# Altium schematic sheet MicroSD.SchDoc
size A4; SheetNumber: 5; SheetTotal: 7
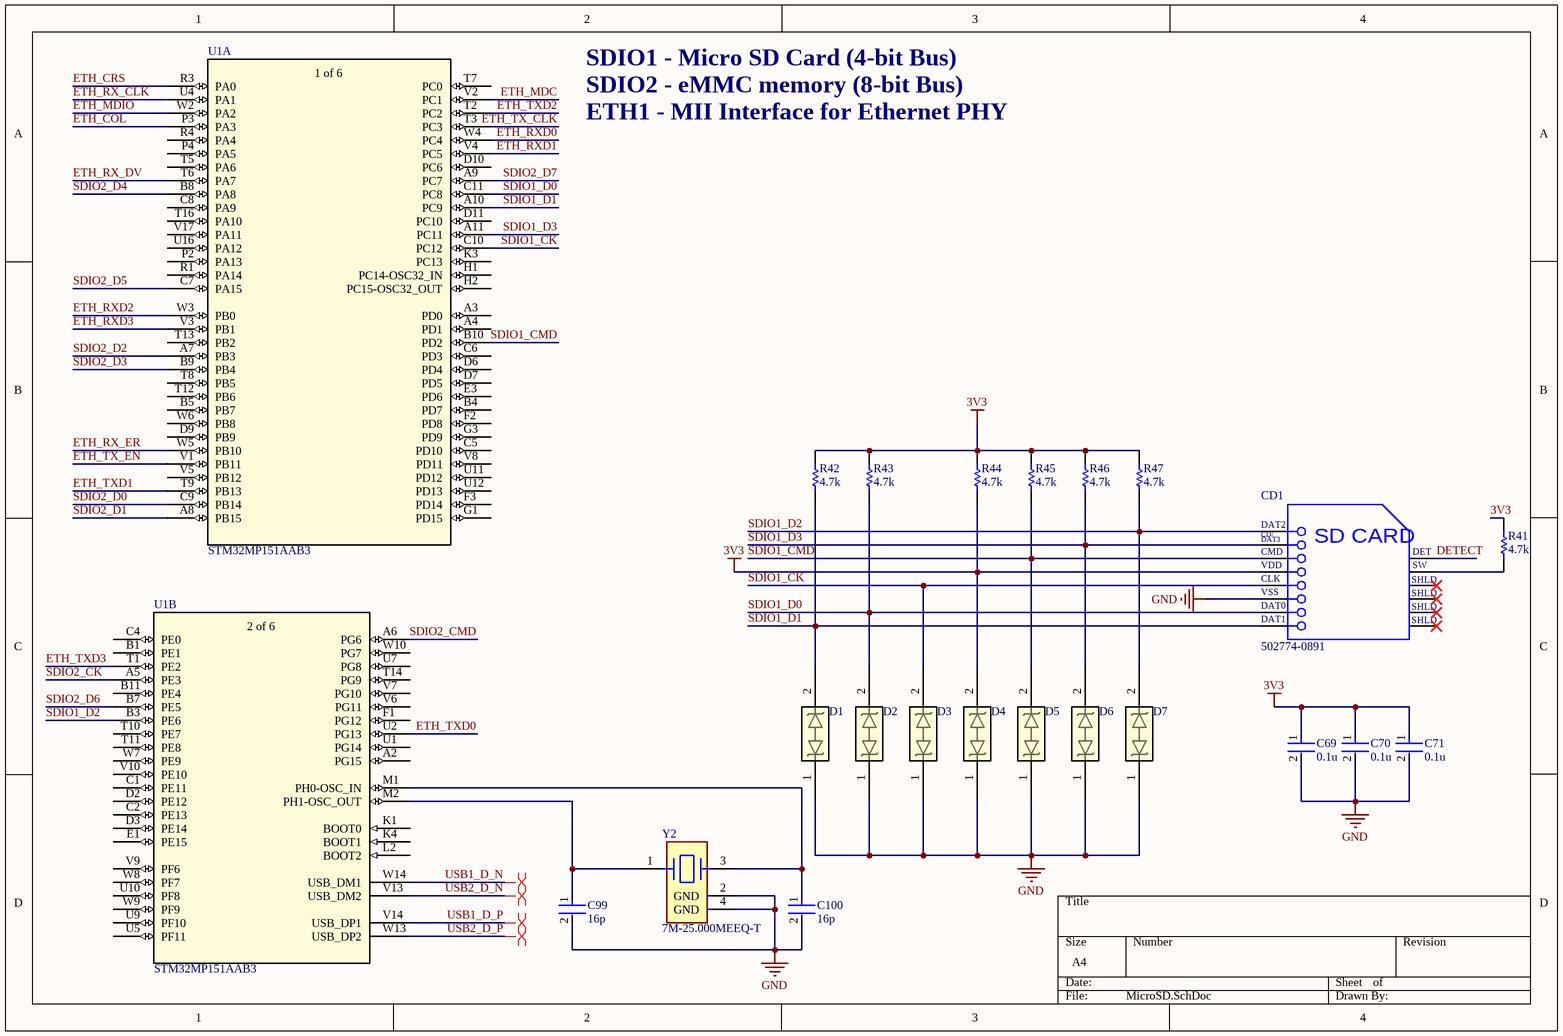
[diagram p0: MicroSD.SchDoc]

## Parts
C69  0.1u  [FP-C0603C-CF-MFG]
C70  0.1u  [FP-C0603C-CF-MFG]
C71  0.1u  [FP-C0603C-CF-MFG]
C99  16p  [FP-C0603C-CF-MFG]
C100  16p  [FP-C0603C-CF-MFG]
CD1  502774-0891  [MOLX-502774-0891_V]
D1  DESD5V0U1BA-7  [SOD-323]  (value not drawn)
D2  DESD5V0U1BA-7  [SOD-323]  (value not drawn)
D3  DESD5V0U1BA-7  [SOD-323]  (value not drawn)
D4  DESD5V0U1BA-7  [SOD-323]  (value not drawn)
D5  DESD5V0U1BA-7  [SOD-323]  (value not drawn)
D6  DESD5V0U1BA-7  [SOD-323]  (value not drawn)
D7  DESD5V0U1BA-7  [SOD-323]  (value not drawn)
R41  4.7k  [RESC1609X50X30NL8T20]
R42  4.7k  [RESC1609X50X30NL8T20]
R43  4.7k  [RESC1609X50X30NL8T20]
R44  4.7k  [RESC1609X50X30NL8T20]
R45  4.7k  [RESC1609X50X30NL8T20]
R46  4.7k  [RESC1609X50X30NL8T20]
R47  4.7k  [RESC1609X50X30NL8T20]
U1  STM32MP151AAB3  [LFBGA354_16X16_STM]  (parts A,B of 6)
Y2  7M-25.000MEEQ-T  [FP-7M-MFG]

## Nets
3V3: C69.1 C70.1 C71.1 CD1.4(VDD) D4.2 R41.2 R42.2 R43.2 R44.1 R44.2 R45.2 R46.2 R47.2
GND: C69.2 C70.2 C71.2 C99.2 C100.2 CD1.6(VSS) D1.1 D2.1 D3.1 D4.1 D5.1 D6.1 D7.1 Y2.2(GND) Y2.4(GND)
DETECT: CD1.9(DETECT)
ETH_COL: U1.P3(PA3)
ETH_CRS: U1.R3(PA0)
ETH_MDC: U1.V2(PC1)
ETH_MDIO: U1.W2(PA2)
ETH_RX_CLK: U1.U4(PA1)
ETH_RX_DV: U1.T6(PA7)
ETH_RX_ER: U1.W5(PB10)
ETH_RXD0: U1.W4(PC4)
ETH_RXD1: U1.V4(PC5)
ETH_RXD2: U1.W3(PB0)
ETH_RXD3: U1.V3(PB1)
ETH_TX_CLK: U1.T3(PC3)
ETH_TX_EN: U1.V1(PB11)
ETH_TXD0: U1.U2(PG13)
ETH_TXD1: U1.T9(PB13)
ETH_TXD2: U1.T2(PC2)
ETH_TXD3: U1.T1(PE2)
SDIO1_CK: CD1.5(CLK) D3.2 U1.C10(PC12)
SDIO1_CMD: CD1.3(CMD) D5.2 R45.1 U1.B10(PD2)
SDIO1_D0: CD1.7(DAT0) D2.2 R43.1 U1.C11(PC8)
SDIO1_D1: CD1.8(DAT1) D1.2 R42.1 U1.A10(PC9)
SDIO1_D2: CD1.1(DAT2) D7.2 R47.1 U1.B3(PE6)
SDIO1_D3: CD1.2(CD/DAT3) D6.2 R46.1 U1.A11(PC11)
SDIO2_CK: U1.A5(PE3)
SDIO2_CMD: U1.A6(PG6)
SDIO2_D0: U1.C9(PB14)
SDIO2_D1: U1.A8(PB15)
SDIO2_D2: U1.A7(PB3)
SDIO2_D3: U1.B9(PB4)
SDIO2_D4: U1.B8(PA8)
SDIO2_D5: U1.C7(PA15)
SDIO2_D6: U1.B7(PE5)
SDIO2_D7: U1.A9(PC7)
USB1_D_N: U1.W14(USB_DM1)
USB1_D_P: U1.V14(USB_DP1)
USB2_D_N: U1.V13(USB_DM2)
USB2_D_P: U1.W13(USB_DP2)
NetC99_1: C99.1 U1.M2(PH1-OSC_OUT) Y2.1
NetC100_1: C100.1 U1.M1(PH0-OSC_IN) Y2.3
NetCD1_10: CD1.10(SWITCH) R41.1

Not connected (* = marked no-connect by the designer): CD1 11(SHLD)* 12(SHLD)* 13(SHLD)* 14(SHLD)*; U1 A2(PG15) A3(PD0) A4(PD1) B1(PE1) B4(PD7) B5(PB7) B11(PE4) C1(PE11) C2(PE13) C4(PE0) C5(PD10) C6(PD3) C8(PA9) D2(PE12) D3(PE14) D6(PD4) D7(PD5) D9(PB9) D10(PC6) D11(PC10) E1(PE15) E3(PD6) F1(PG12) F2(PD8) F3(PD14) G1(PD15) G3(PD9) H1(PC14-OSC32_IN) H2(PC15-OSC32_OUT) K1(BOOT0) K3(PC13) K4(BOOT1) L2(BOOT2) P2(PA13) P4(PA5) R1(PA14) R4(PA4) T5(PA6) T7(PC0) T8(PB5) T10(PE7) T11(PE8) T12(PB6) T13(PB2) T14(PG9) T16(PA10) U1(PG14) U5(PF11) U7(PG8) U9(PF10) U10(PF8) U11(PD12) U12(PD13) U16(PA12) V5(PB12) V6(PG11) V7(PG10) V8(PD11) V9(PF6) V10(PE10) V17(PA11) W6(PB8) W7(PE9) W8(PF7) W9(PF9) W10(PG7)

## Layout directives
differential pair: USB1_D_N, USB1_D_P, USB2_D_N, USB2_D_P

## Notes on the sheet
- SDIO1 - Micro SD Card (4-bit Bus)
- SDIO2 - eMMC memory (8-bit Bus)
- ETH1 - MII Interface for Ethernet PHY
- (in symbol CMP-2000-05248-1) CD/; DAT3; SD CARD; DET; SW
- (in symbol STM32MP151AAB3, part A) 1 of 6
- (in symbol STM32MP151AAB3, part B) 2 of 6

## Library data of the parts
C69-C71 C99 C100 = CMP-2006-03061-2: CAP CER 0.1UF 50V X7R 0603; Manufacturer: KEMET; Manufacturer Part Number: C0603C104K5RACTU; Tolerance: 0.1; Temperature Coefficient: 30ppm/°C; Material: Ceramic; Automotive Grade: Grade 1; Value: 0.10 μF; Temperature: -55°C to +125°C; RoHS: TRUE; Temperature Range High: +125°C; Lead Free: Yes; Octopart: https://octopart.com/c0603c104k5ractu-kemet-139244; Digikey Description: CAP CER 0.1UF 50V X7R 0603; Category: Cap; Package: C0603C-CF; ComponentLink2Description: Datasheet; Temperature Range Low: -55°C; Device Class L1: Passive Components; Voltage Rating: 50 V; Automotive: Yes; Device Class L3: Ceramic Capacitors; ComponentLink2URL: https://api.kemet.com/component-edge/download/datasheet/C0603C100J5GACAUTO.pdf; Capacitance: 0.10 μF; Device Class L2: Capacitors; Temperature Characteristic: X7R; Height: 0.87mm
CD1 = CMP-2000-05248-1: Micro SD Memory Card Connector, 0.5 A, 10 V (DC), -25 to 85 degC, 8-Pin SMT, RoHS, Tape and Reel; Manufacturer: Molex; 3D Model: 502774-0891.stp; Online Catalog: microSD™Series; Number of Positions: 10(8+2); Card Type: SecureDigital-microSD™; Insertion, Removal Method: PushIn,PushOut; Other Names: WM24066DKR; Connector Type: ConnectorandEjector; Features: Switch; Family: MemoryConnectors-PCCardSockets; Manufacturer URL: http://www.molex.com/; Mounting Type: SurfaceMount,RightAngle; Contact Finish Thickness: 20µin(0.51µm); Standard Package: 1; Series: 502774; Ejector Side: -; Datasheet Version: Rev. D, 04/2004; Category: Connectors,Interconnects; Contact Finish: Gold; Datasheet URL: https://datasheet.ciiva.com/1104/1499551-1104671.pdf; RoHS Information: 502774-0891CertofCompliance; Mounting Feature: Reverse-Bottom; Packaging: Digi-Reel; Height Above Board: 0.071"(1.80mm); Catalog Drawings: 502774-0891
D1-D7 = DESD5V0U1BA-7: No Description Available; Mfr_Name: Diodes Inc; Type: DEV; Copyright: Copyright (C) 2023 Ultra Librarian. All rights reserved.; Manufacturer_Part_Number: DESD5V0U1BA-7; RefDes: RefDes
R41-R47 = CMP-1666-00005-4: Chip Resistor, 10 KOhm, +/- 1%, 100 mW, -55 to 155 degC, 0603 (1608 Metric), RoHS, Tape and Reel; Manufacturer: Vishay Semiconductor; Voltage Rating: 75 V; Max Operating Temperature: 155 degC; PackageDescription: 2-Pin Surface Mount Device, Body 1.575 x 0.85 mm; ComponentLink1Description: Manufacturer URL; RoHSCompliant: true; PackageReference: 0603; REACH SVHC: Unknown; Length: 1.55 mm; DatasheetVersion: 06/2012; Packaging: Tape and Reel; Min Operating Temperature: -55 degC; Mounting Technology: Surface Mount; ComponentLink2URL: https://datasheet.ciiva.com/11809/0900766b80d98afc-11809037.pdf; Height: 0.45 mm; ComponentLink2Description: Datasheet; Package Quantity: 5000; ComponentLink1URL: http://www.vishay.com/
U1 = STM32MP151AAB3: No Description Available; Mfr_Name: STMicroelectronics; RefDes: RefDes; Type: Type
Y2 = CMP-18717-000310-1: Crystal 25MHz, 10ppm, 10pF, 50Ω; ESR (Equivalent Series Resistance): 60R; Package Quantity: 3000; Frequency: 25MHz; Width: 0.098inch; Depth: 2.5mm; Series: 7M; Case/Package: SMD/SMT; Min Operating Temperature: -20°C; Frequency Stability: 10ppm; Termination: SMD/SMT; Max Operating Temperature: 70°C; REACH SVHC: No SVHC; Length: 3.2mm; Number of Pins: 4; Frequency Tolerance: 10ppm; Mount: Surface Mount; Tolerance: 10ppm; Height: 0.031inch; Load Capacitance: 10pF; Packaging: Tape and Reel